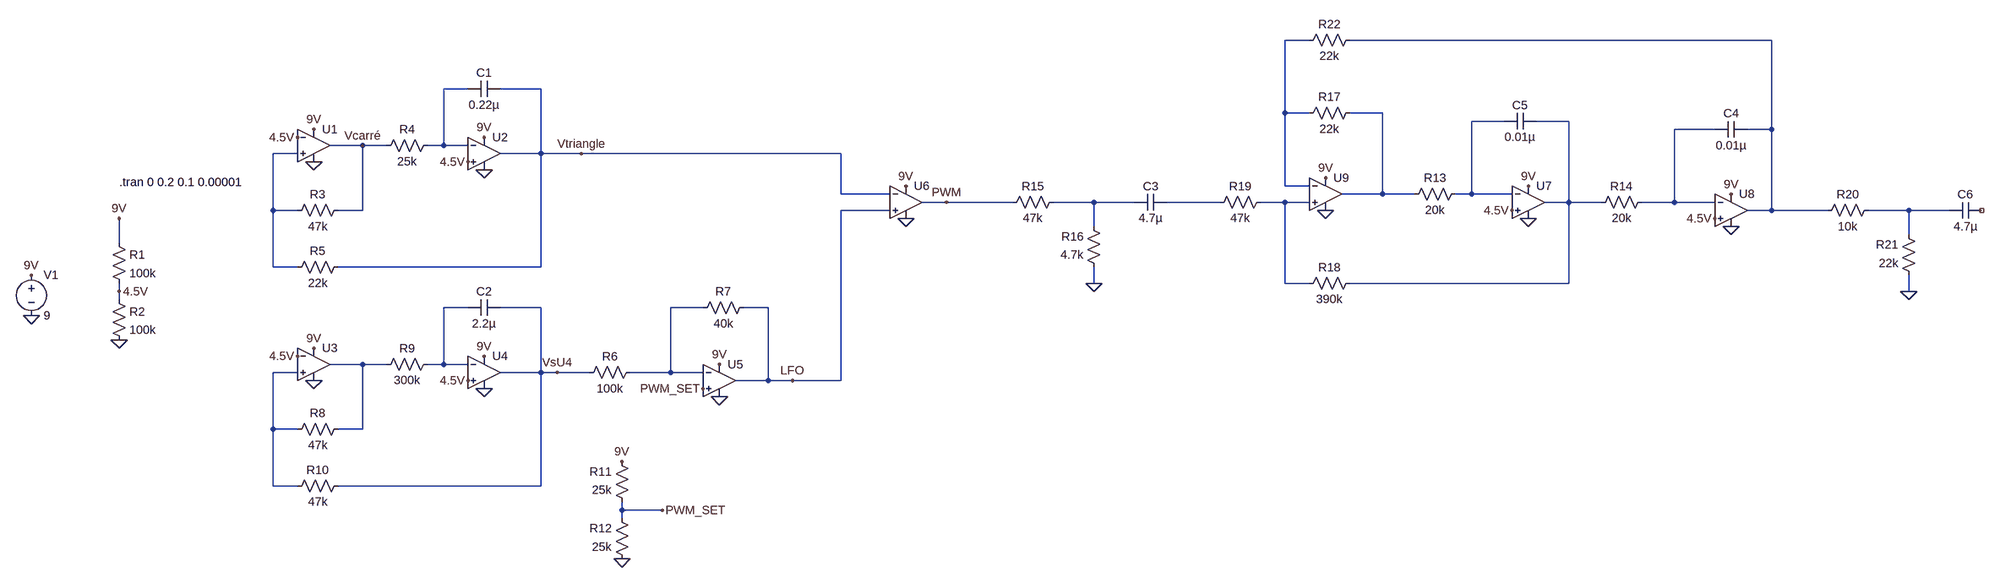
[diagram p0: schematic Synthé.asc]
Synthé.asc, the LTspice schematic file:
Version 4
SHEET 1 4264 1092
WIRE 2192 48 2144 48
WIRE 3104 48 2272 48
WIRE 464 144 416 144
WIRE 608 144 528 144
WIRE 2144 192 2144 48
WIRE 2192 192 2144 192
WIRE 2336 192 2272 192
WIRE 2576 208 2512 208
WIRE 2704 208 2640 208
WIRE 2992 224 2912 224
WIRE 3104 224 3104 48
WIRE 3104 224 3056 224
WIRE 256 256 192 256
WIRE 304 256 256 256
WIRE 416 256 416 144
WIRE 416 256 384 256
WIRE 464 256 416 256
WIRE 128 272 80 272
WIRE 608 272 608 144
WIRE 608 272 528 272
WIRE 688 272 608 272
WIRE 1200 272 688 272
WIRE 2144 336 2144 192
WIRE 2192 336 2144 336
WIRE 1200 352 1200 272
WIRE 1296 352 1200 352
WIRE 2336 352 2336 192
WIRE 2336 352 2256 352
WIRE 2400 352 2336 352
WIRE 2512 352 2512 208
WIRE 2512 352 2480 352
WIRE 2592 352 2512 352
WIRE 1408 368 1360 368
WIRE 1552 368 1408 368
WIRE 1712 368 1632 368
WIRE 1792 368 1712 368
WIRE 2016 368 1856 368
WIRE 2144 368 2096 368
WIRE 2192 368 2144 368
WIRE 2704 368 2704 208
WIRE 2704 368 2656 368
WIRE 2768 368 2704 368
WIRE 2912 368 2912 224
WIRE 2912 368 2848 368
WIRE 2992 368 2912 368
WIRE 80 384 80 272
WIRE 128 384 80 384
WIRE 256 384 256 256
WIRE 256 384 208 384
WIRE 1296 384 1200 384
WIRE 3104 384 3104 224
WIRE 3104 384 3056 384
WIRE 3216 384 3104 384
WIRE 3376 384 3296 384
WIRE 3456 384 3376 384
WIRE 1712 416 1712 368
WIRE 3376 432 3376 384
WIRE -224 448 -224 400
WIRE 80 496 80 384
WIRE 128 496 80 496
WIRE 608 496 608 272
WIRE 608 496 208 496
WIRE 1712 528 1712 496
WIRE 2144 528 2144 368
WIRE 2192 528 2144 528
WIRE 2704 528 2704 368
WIRE 2704 528 2272 528
WIRE -224 544 -224 528
WIRE 3376 544 3376 512
WIRE -224 560 -224 544
WIRE 464 576 416 576
WIRE 608 576 528 576
WIRE 928 576 864 576
WIRE 1056 576 1008 576
WIRE 256 688 192 688
WIRE 304 688 256 688
WIRE 416 688 416 576
WIRE 416 688 384 688
WIRE 464 688 416 688
WIRE 128 704 80 704
WIRE 608 704 608 576
WIRE 608 704 528 704
WIRE 640 704 608 704
WIRE 704 704 640 704
WIRE 864 704 864 576
WIRE 864 704 784 704
WIRE 928 704 864 704
WIRE 1056 720 1056 576
WIRE 1056 720 992 720
WIRE 1104 720 1056 720
WIRE 1200 720 1200 384
WIRE 1200 720 1104 720
WIRE 80 816 80 704
WIRE 128 816 80 816
WIRE 256 816 256 688
WIRE 256 816 208 816
WIRE 80 928 80 816
WIRE 128 928 80 928
WIRE 608 928 608 704
WIRE 608 928 208 928
WIRE 768 976 768 960
WIRE 848 976 768 976
WIRE 768 992 768 976
FLAG -432 592 0
FLAG -432 512 9V
FLAG 160 224 9V
FLAG 160 288 0
FLAG -224 640 0
FLAG -224 400 9V
FLAG -224 544 4.5V
FLAG 464 288 4.5V
FLAG 128 240 4.5V
FLAG 496 304 0
FLAG 496 240 9V
FLAG 160 656 9V
FLAG 160 720 0
FLAG 464 720 4.5V
FLAG 128 672 4.5V
FLAG 496 736 0
FLAG 496 672 9V
FLAG 960 752 0
FLAG 960 688 9V
FLAG 768 880 9V
FLAG 768 1072 0
FLAG 848 976 PWM_SET
FLAG 928 736 PWM_SET
FLAG 1328 400 0
FLAG 1328 336 9V
FLAG 1408 368 PWM
FLAG 1104 720 LFO
FLAG 640 704 VsU4
FLAG 688 272 Vtriangle
FLAG 2624 400 0
FLAG 2624 336 9V
FLAG 2592 384 4.5V
FLAG 2992 400 4.5V
FLAG 3024 352 9V
FLAG 3024 416 0
FLAG 1712 528 0
FLAG 2224 320 9V
FLAG 2224 384 0
FLAG 3376 544 0
FLAG 256 256 Vcarré
SYMBOL Opamps\\UniversalOpamp2 160 256 R0
SYMATTR InstName U1
SYMBOL res -240 432 R0
SYMATTR InstName R1
SYMATTR Value 100k
SYMBOL res -240 544 R0
SYMATTR InstName R2
SYMATTR Value 100k
SYMBOL res 224 368 R90
WINDOW 0 0 56 VBottom 2
WINDOW 3 32 56 VTop 2
SYMATTR InstName R3
SYMATTR Value 47k
SYMBOL voltage -432 496 R0
WINDOW 123 0 0 Left 2
WINDOW 39 0 0 Left 2
SYMATTR InstName V1
SYMATTR Value 9
SYMBOL res 400 240 R90
WINDOW 0 0 56 VBottom 2
WINDOW 3 32 56 VTop 2
SYMATTR InstName R4
SYMATTR Value 25k
SYMBOL Opamps\\UniversalOpamp2 496 272 R0
SYMATTR InstName U2
SYMBOL res 224 480 R90
WINDOW 0 0 56 VBottom 2
WINDOW 3 32 56 VTop 2
SYMATTR InstName R5
SYMATTR Value 22k
SYMBOL cap 528 128 R90
WINDOW 0 0 32 VBottom 2
WINDOW 3 32 32 VTop 2
SYMATTR InstName C1
SYMATTR Value 0.22µ
SYMBOL Opamps\\UniversalOpamp2 160 688 R0
SYMATTR InstName U3
SYMBOL res 224 800 R90
WINDOW 0 0 56 VBottom 2
WINDOW 3 32 56 VTop 2
SYMATTR InstName R8
SYMATTR Value 47k
SYMBOL res 400 672 R90
WINDOW 0 0 56 VBottom 2
WINDOW 3 32 56 VTop 2
SYMATTR InstName R9
SYMATTR Value 300k
SYMBOL Opamps\\UniversalOpamp2 496 704 R0
SYMATTR InstName U4
SYMBOL res 224 912 R90
WINDOW 0 0 56 VBottom 2
WINDOW 3 32 56 VTop 2
SYMATTR InstName R10
SYMATTR Value 47k
SYMBOL cap 528 560 R90
WINDOW 0 0 32 VBottom 2
WINDOW 3 32 32 VTop 2
SYMATTR InstName C2
SYMATTR Value 2.2µ
SYMBOL Opamps\\UniversalOpamp2 960 720 R0
SYMATTR InstName U5
SYMBOL res 800 688 R90
WINDOW 0 0 56 VBottom 2
WINDOW 3 32 56 VTop 2
SYMATTR InstName R6
SYMATTR Value 100k
SYMBOL res 1024 560 R90
WINDOW 0 0 56 VBottom 2
WINDOW 3 32 56 VTop 2
SYMATTR InstName R7
SYMATTR Value 40k
SYMBOL res 784 976 R180
WINDOW 0 36 76 Left 2
WINDOW 3 36 40 Left 2
SYMATTR InstName R11
SYMATTR Value 25k
SYMBOL res 784 1088 R180
WINDOW 0 36 76 Left 2
WINDOW 3 36 40 Left 2
SYMATTR InstName R12
SYMATTR Value 25k
SYMBOL Opamps\\UniversalOpamp2 1328 368 R0
SYMATTR InstName U6
SYMBOL Opamps\\UniversalOpamp2 2624 368 R0
SYMATTR InstName U7
SYMBOL res 2496 336 R90
WINDOW 0 0 56 VBottom 2
WINDOW 3 32 56 VTop 2
SYMATTR InstName R13
SYMATTR Value 20k
SYMBOL res 2864 352 R90
WINDOW 0 0 56 VBottom 2
WINDOW 3 32 56 VTop 2
SYMATTR InstName R14
SYMATTR Value 20k
SYMBOL Opamps\\UniversalOpamp2 3024 384 R0
SYMATTR InstName U8
SYMBOL cap 3056 208 R90
WINDOW 0 0 32 VBottom 2
WINDOW 3 32 32 VTop 2
SYMATTR InstName C4
SYMATTR Value 0.01µ
SYMBOL cap 2640 192 R90
WINDOW 0 0 32 VBottom 2
WINDOW 3 32 32 VTop 2
SYMATTR InstName C5
SYMATTR Value 0.01µ
SYMBOL res 1648 352 R90
WINDOW 0 0 56 VBottom 2
WINDOW 3 32 56 VTop 2
SYMATTR InstName R15
SYMATTR Value 47k
SYMBOL res 1728 512 R180
WINDOW 0 36 76 Left 2
WINDOW 3 36 40 Left 2
SYMATTR InstName R16
SYMATTR Value 4.7k
SYMBOL cap 1856 352 R90
WINDOW 0 0 32 VBottom 2
WINDOW 3 32 32 VTop 2
SYMATTR InstName C3
SYMATTR Value 4.7µ
SYMBOL Opamps\\UniversalOpamp2 2224 352 R0
SYMATTR InstName U9
SYMBOL res 2288 176 R90
WINDOW 0 0 56 VBottom 2
WINDOW 3 32 56 VTop 2
SYMATTR InstName R17
SYMATTR Value 22k
SYMBOL res 2288 512 R90
WINDOW 0 0 56 VBottom 2
WINDOW 3 32 56 VTop 2
SYMATTR InstName R18
SYMATTR Value 390k
SYMBOL res 2112 352 R90
WINDOW 0 0 56 VBottom 2
WINDOW 3 32 56 VTop 2
SYMATTR InstName R19
SYMATTR Value 47k
SYMBOL res 3312 368 R90
WINDOW 0 0 56 VBottom 2
WINDOW 3 32 56 VTop 2
SYMATTR InstName R20
SYMATTR Value 10k
SYMBOL res 3392 528 R180
WINDOW 0 36 76 Left 2
WINDOW 3 36 40 Left 2
SYMATTR InstName R21
SYMATTR Value 22k
SYMBOL cap 3520 368 R90
WINDOW 0 0 32 VBottom 2
WINDOW 3 32 32 VTop 2
SYMATTR InstName C6
SYMATTR Value 4.7µ
SYMBOL res 2288 32 R90
WINDOW 0 0 56 VBottom 2
WINDOW 3 32 56 VTop 2
SYMATTR InstName R22
SYMATTR Value 22k
TEXT -224 328 Left 2 !.tran 0 0.2 0.1 0.00001

The netlist it stands for:
* Synthé.asc
XU1 N008 4.5V 9V 0 Vcarré level.2 Avol=1Meg GBW=10Meg Slew=10Meg ilimit=25m rail=0 Vos=0 phimargin=45 en=0 enk=0 in=0 ink=0 Rin=500Meg  ; pins IN+ IN- V+ V- OUT
R1 9V 4.5V 100k
R2 4.5V 0 100k
R3 Vcarré N008 47k
V1 9V 0 9
R4 N003 Vcarré 25k
XU2 4.5V N003 9V 0 Vtriangle level.2 Avol=1Meg GBW=10Meg Slew=10Meg ilimit=25m rail=0 Vos=0 phimargin=45 en=0 enk=0 in=0 ink=0 Rin=500Meg  ; pins IN+ IN- V+ V- OUT
R5 Vtriangle N008 22k
C1 Vtriangle N003 0.22µ
XU3 N016 4.5V 9V 0 N015 level.2 Avol=1Meg GBW=10Meg Slew=10Meg ilimit=25m rail=0 Vos=0 phimargin=45 en=0 enk=0 in=0 ink=0 Rin=500Meg  ; pins IN+ IN- V+ V- OUT
R8 N015 N016 47k
R9 N013 N015 300k
XU4 4.5V N013 9V 0 VsU4 level.2 Avol=1Meg GBW=10Meg Slew=10Meg ilimit=25m rail=0 Vos=0 phimargin=45 en=0 enk=0 in=0 ink=0 Rin=500Meg  ; pins IN+ IN- V+ V- OUT
R10 VsU4 N016 47k
C2 VsU4 N013 2.2µ
XU5 PWM_SET N014 9V 0 LFO level.2 Avol=1Meg GBW=10Meg Slew=10Meg ilimit=25m rail=0 Vos=0 phimargin=45 en=0 enk=0 in=0 ink=0 Rin=500Meg  ; pins IN+ IN- V+ V- OUT
R6 N014 VsU4 100k
R7 LFO N014 40k
R11 PWM_SET 9V 25k
R12 0 PWM_SET 25k
XU6 LFO Vtriangle 9V 0 PWM level.2 Avol=1Meg GBW=10Meg Slew=10Meg ilimit=25m rail=0 Vos=0 phimargin=45 en=0 enk=0 in=0 ink=0 Rin=500Meg  ; pins IN+ IN- V+ V- OUT
XU7 4.5V N005 9V 0 N006 level.2 Avol=1Meg GBW=10Meg Slew=10Meg ilimit=25m rail=0 Vos=0 phimargin=45 en=0 enk=0 in=0 ink=0 Rin=500Meg  ; pins IN+ IN- V+ V- OUT
R13 N005 N004 20k
R14 N007 N006 20k
XU8 4.5V N007 9V 0 N002 level.2 Avol=1Meg GBW=10Meg Slew=10Meg ilimit=25m rail=0 Vos=0 phimargin=45 en=0 enk=0 in=0 ink=0 Rin=500Meg  ; pins IN+ IN- V+ V- OUT
C4 N002 N007 0.01µ
C5 N006 N005 0.01µ
R15 N009 PWM 47k
R16 0 N009 4.7k
C3 N010 N009 4.7µ
XU9 N011 N001 9V 0 N004 level.2 Avol=1Meg GBW=10Meg Slew=10Meg ilimit=25m rail=0 Vos=0 phimargin=45 en=0 enk=0 in=0 ink=0 Rin=500Meg  ; pins IN+ IN- V+ V- OUT
R17 N004 N001 22k
R18 N006 N011 390k
R19 N011 N010 47k
R20 N012 N002 10k
R21 0 N012 22k
C6 NC_01 N012 4.7µ
R22 N002 N001 22k
.tran 0 0.2 0.1 0.00001
.lib UniversalOpamps2.sub
.backanno
.end